# EAGLE design HyperArmBoard (EAGLE 8.6.0)
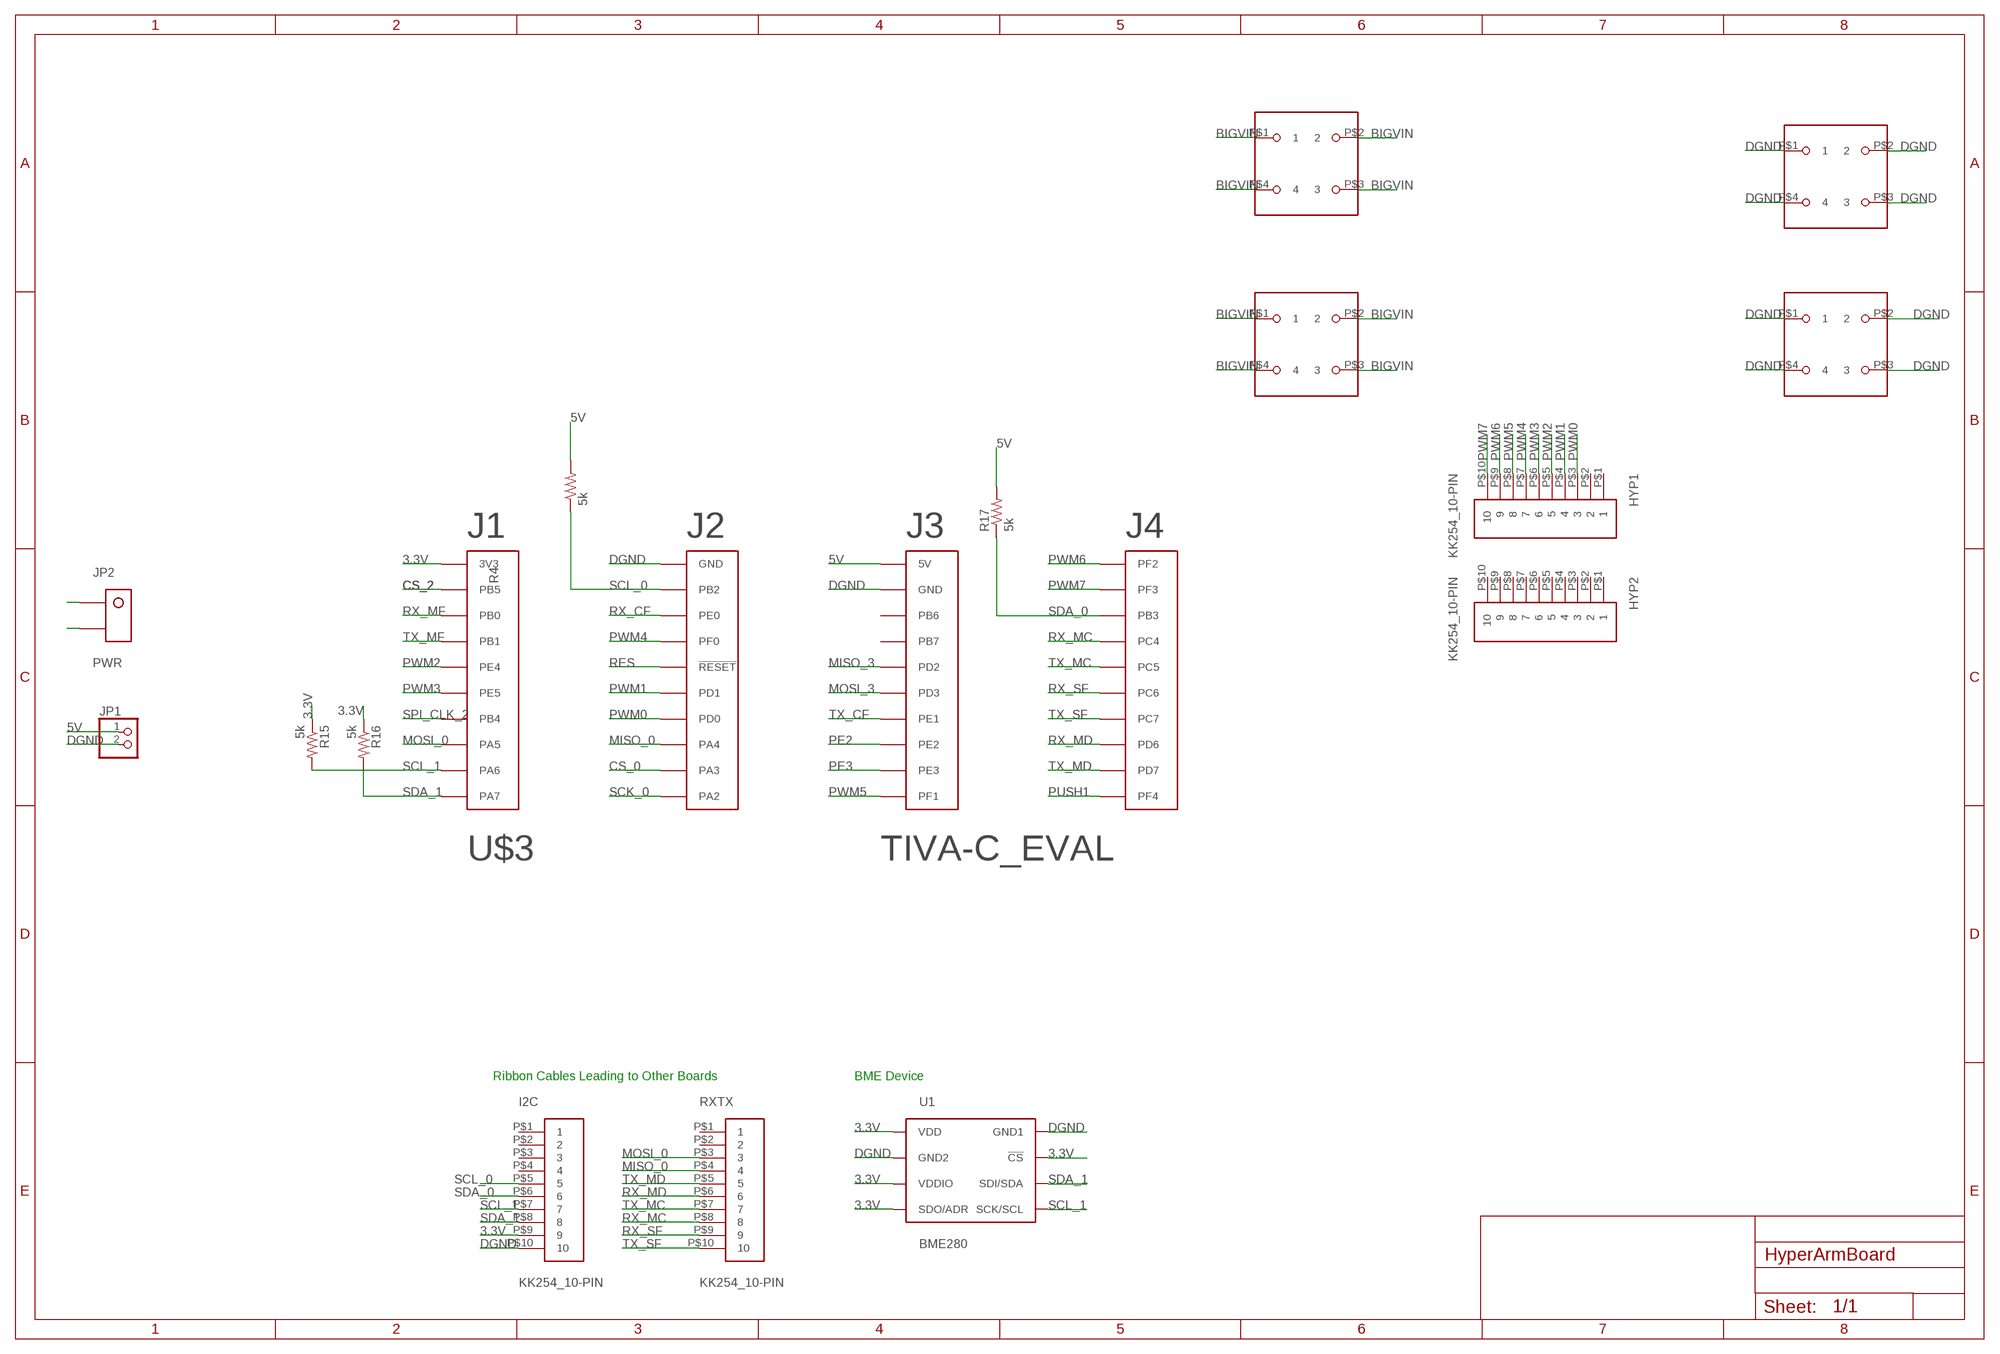
[diagram p0: schematic, sheet 1]

## Parts
HYP1  KK254_10-PIN  [KK254_10-PIN]
HYP2  KK254_10-PIN  [KK254_10-PIN]
I2C  KK254_10-PIN  [KK254_10-PIN]
JP1  PINHD-1X2  [1X02]
JP2  PWR  2_SUPERSABRE  [SUPERSABRE_2CIRCUIT]
R4  5k  R-US_R0805  [R0805]
R15  5k  R-US_R0805  [R0805]
R16  5k  R-US_R0805  [R0805]
R17  5k  R-US_R0805  [R0805]
RXTX  KK254_10-PIN  [KK254_10-PIN]
U1  BME280  [BME280_LGA]
U$3  TIVA-C_EVAL  [TIVA-C_EVAL]
U$4  BCS-106-L-D-PE-BE  [4-PIN-BIGPOWER]
U$5  BCS-106-L-D-PE-BE  [4-PIN-BIGPOWER]
U$6  BCS-106-L-D-PE-BE  [4-PIN-BIGPOWER]
U$7  BCS-106-L-D-PE-BE  [4-PIN-BIGPOWER]

## Nets
3.3V: I2C.P$9 R15.1 R16.1 U1.P$2(!CS) U1.P$5(SDO/ADR) U1.P$6(VDDIO) U1.P$8(VDD) U$3.1-1(3V3)
5V: JP1.1 R4.2 R17.2 U$3.3-1(5V)
BIGVIN: JP2.P$1 U$4.P$1 U$4.P$2 U$4.P$3 U$4.P$4 U$5.P$1 U$5.P$2 U$5.P$3 U$5.P$4
CS_0: U$3.2-9(PA3)
CS_2: U$3.1-2(PB5)
DGND: I2C.P$10 JP1.2 JP2.P$2 U1.P$1(GND1) U1.P$7(GND2) U$3.2-1(GND) U$3.3-2(GND) U$6.P$1 U$6.P$2 U$6.P$3 U$6.P$4 U$7.P$1 U$7.P$2 U$7.P$3 U$7.P$4
MISO_0: RXTX.P$4 U$3.2-8(PA4)
MISO_3: U$3.3-5(PD2)
MOSI_0: RXTX.P$3 U$3.1-8(PA5)
MOSI_3: U$3.3-6(PD3)
PE2: U$3.3-8(PE2)
PE3: U$3.3-9(PE3)
PUSH1: U$3.4-10(PF4)
PWM0: HYP1.P$3 U$3.2-7(PD0)
PWM1: HYP1.P$4 U$3.2-6(PD1)
PWM2: HYP1.P$5 U$3.1-5(PE4)
PWM3: HYP1.P$6 U$3.1-6(PE5)
PWM4: HYP1.P$7 U$3.2-4(PF0)
PWM5: HYP1.P$8 U$3.3-10(PF1)
PWM6: HYP1.P$9 U$3.4-1(PF2)
PWM7: HYP1.P$10 U$3.4-2(PF3)
RES: U$3.2-5(!RESET!)
RX_CF: U$3.2-3(PE0)
RX_MC: RXTX.P$8 U$3.4-4(PC4)
RX_MD: RXTX.P$6 U$3.4-8(PD6)
RX_MF: U$3.1-3(PB0)
RX_SF: RXTX.P$9 U$3.4-6(PC6)
SCK_0: U$3.2-10(PA2)
SCL_0: I2C.P$5 R4.1 U$3.2-2(PB2)
SCL_1: I2C.P$7 R15.2 U1.P$4(SCK/SCL) U$3.1-9(PA6)
SDA_0: I2C.P$6 R17.1 U$3.4-3(PB3)
SDA_1: I2C.P$8 R16.2 U1.P$3(SDI/SDA) U$3.1-10(PA7)
SPI_CLK_2: U$3.1-7(PB4)
TX_CF: U$3.3-7(PE1)
TX_MC: RXTX.P$7 U$3.4-5(PC5)
TX_MD: RXTX.P$5 U$3.4-9(PD7)
TX_MF: U$3.1-4(PB1)
TX_SF: RXTX.P$10 U$3.4-7(PC7)
Unconnected: HYP1.P$1 HYP1.P$2 HYP2.P$1 HYP2.P$2 HYP2.P$3 HYP2.P$4 HYP2.P$5 HYP2.P$6 HYP2.P$7 HYP2.P$8 HYP2.P$9 HYP2.P$10 I2C.P$1 I2C.P$2 I2C.P$3 I2C.P$4 RXTX.P$1 RXTX.P$2 U$3.3-3(PB6) U$3.3-4(PB7)

## Notes on the sheet
- Ribbon Cables Leading to Other Boards | BME Device

## Library data of the parts
HYP1 HYP2 I2C RXTX = molex:KK254_10-PIN: KK254 10-pin Datasheet <http://www.molex.com/molex/products/datasheet.jsp?part=active/0022102101_PCB_HEADERS.xml>
JP1 = pinhead:PINHD-1X2: PIN HEADER
JP2 = molex:2_SUPERSABRE: Molex SuperSabre 2-pin vertical header
R4 R15-R17 = resistor:R-US_: RESISTOR, American symbol
U1 = BME280ComponentLibrary:BME280; PROD_ID: IC-13090
U$3 = texas:TIVA-C_EVAL: Texas Instruments Tiva-C TM4C123G LaunchPad Evaluation Board Part number EK-TM4C123GXL Datasheet <http://www.ti.com/lit/ug/spmu296/spmu296.pdf> Microcontroller <http://www.ti.com/lit/ds/spms376e/spms376e.pdf>
U$4-U$7 = samtec:BCS-106-L-D-PE-BE

## Board
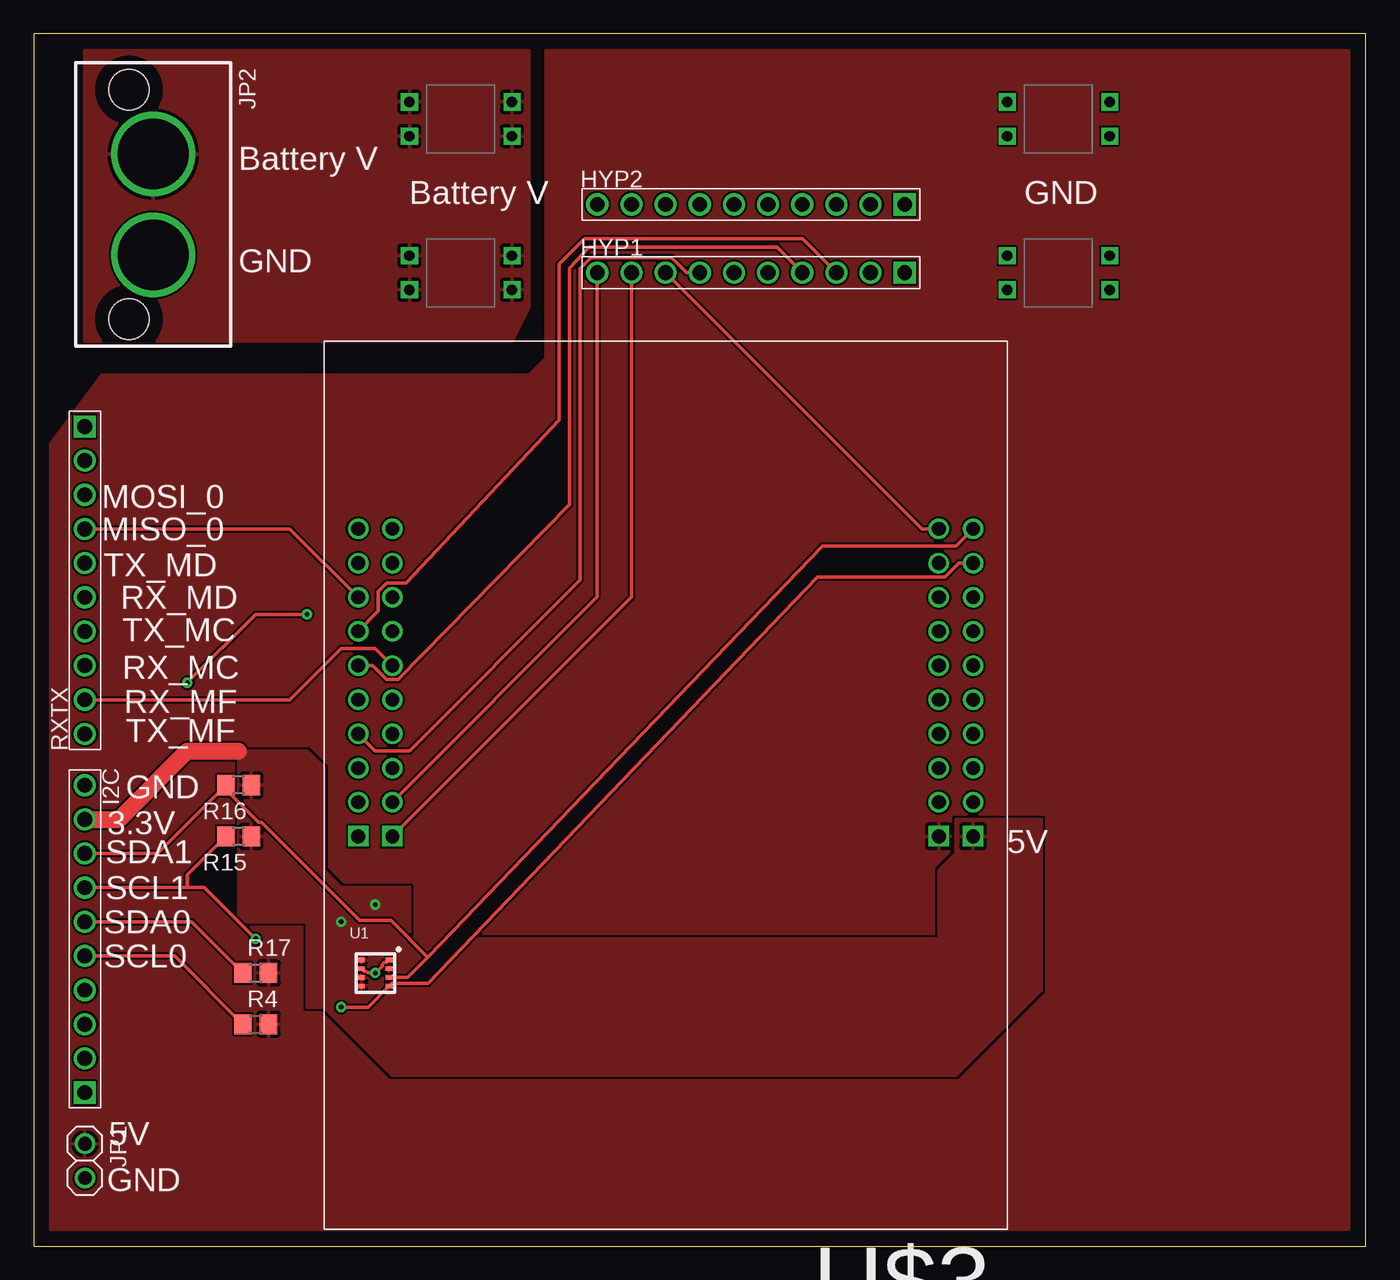
[diagram p1: board, top side]
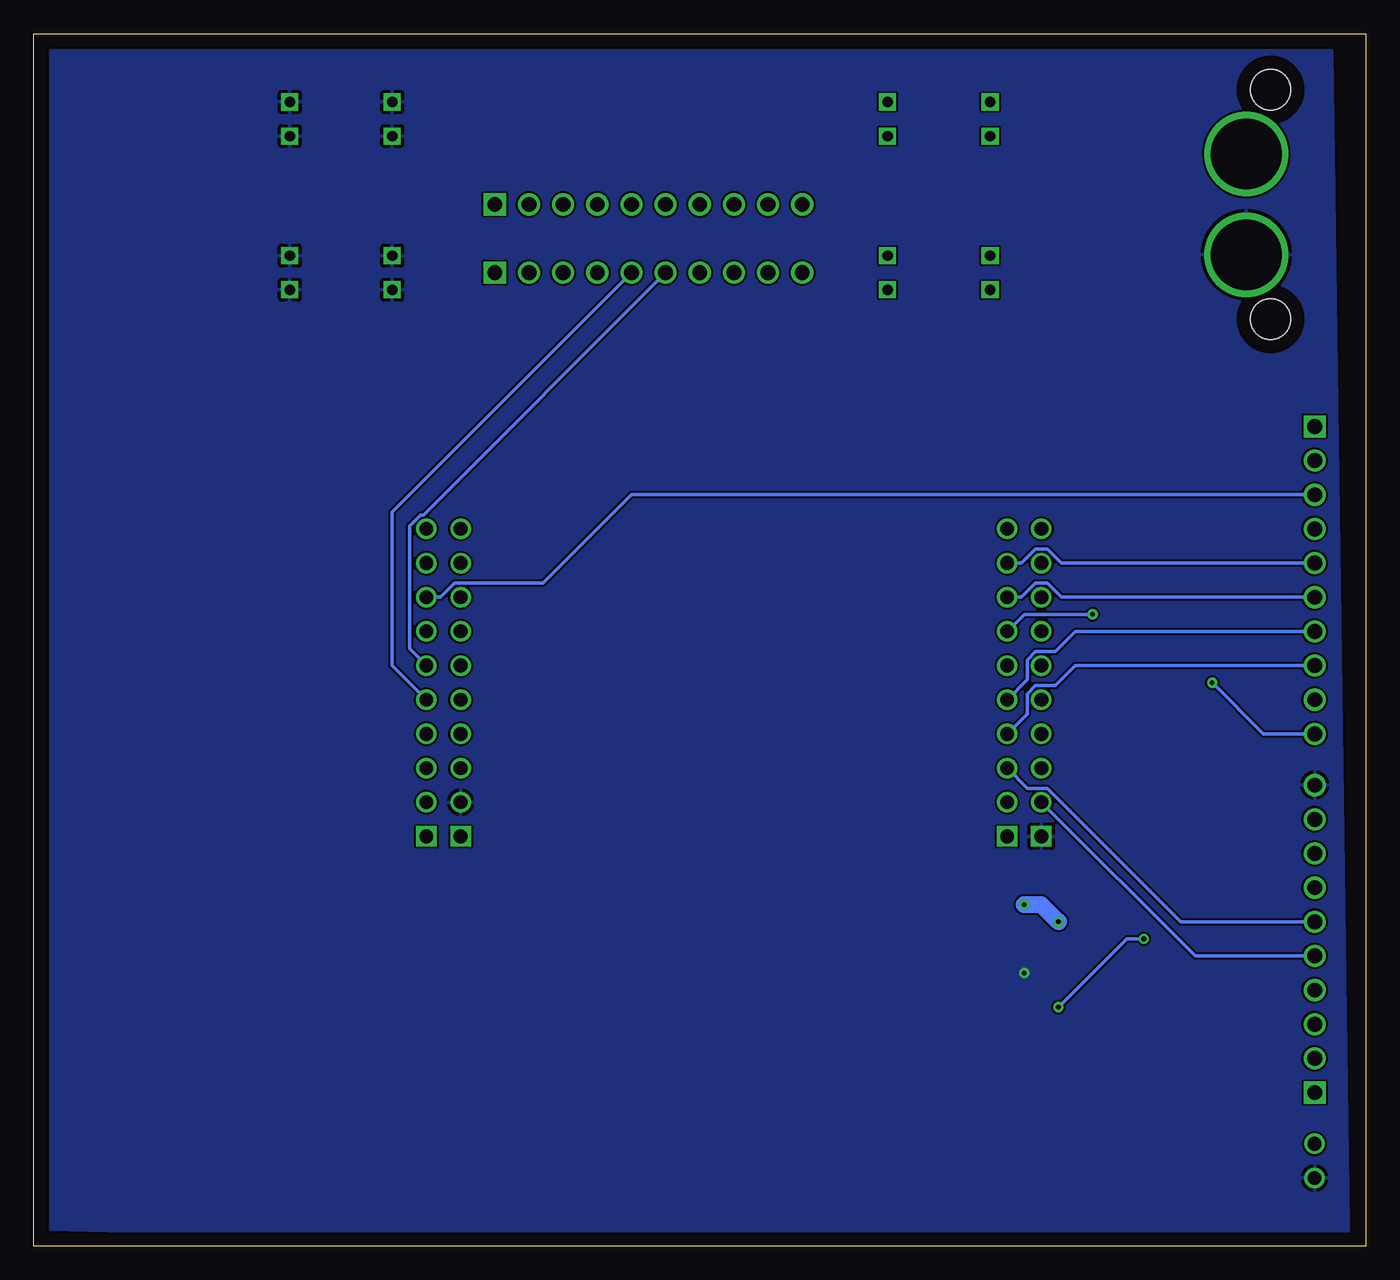
[diagram p2: board, bottom side, seen from below]

Size 99.06 x 90.17 mm. Coordinates in mm from the lower left corner, seen from the top.
Outline: 0,0 99.06,0 99.06,90.17 0,90.17 0,0
Copper layers (1*16): Top 0.035mm / dielectric 1.5mm / Bottom 0.035mm
Design rules "default *": minimum track width 6mil, minimum drill 0.35mm, track to track 6mil, track to pad 6mil, pad to pad 6mil, via to via 6mil, smd to smd 6mil, copper to edge 40mil, drill to drill 6mil, minimum pad ring 10mil, minimum via ring 8mil, stop-mask expansion 4mil, vias tented up to drill 0mil, thermal gap 10mil

### Footprints (pad centres in the part's own frame; a part is rotated, then mirrored left to right if it is on the bottom)
KK254_10-PIN = drill 1.1 square: P$1 11.43,0 | drill 1.1: P$2 8.89,0; P$3 6.35,0; P$4 3.81,0; P$5 1.27,0; P$6 -1.27,0; P$7 -3.81,0; P$8 -6.35,0; P$9 -8.89,0; P$10 -11.43,0
1X02 = drill 1.016: 1 -1.27,0; 2 1.27,0
SUPERSABRE_2CIRCUIT = drill 5.25: P$1 -3.747,0; P$2 3.747,0 | hole 2.997: -8.534,-1.803; 8.534,-1.803
R0805 = smd 1.3 x 1.5: 1 -0.95,0; 2 0.95,0
BME280_LGA = smd 0.5 x 0.35: P$1 1.025,0.975; P$2 1.025,0.325; P$3 1.025,-0.325; P$4 1.025,-0.975; P$5 -1.025,-0.975; P$6 -1.025,-0.325; P$7 -1.025,0.325; P$8 -1.025,0.975
TIVA-C_EVAL = drill 1.016 square: 1-1 -22.86,3.81; 2-1 22.86,3.81; 3-1 -20.32,3.81; 4-1 20.32,3.81 | drill 1.016: 1-2 -22.86,1.27; 1-3 -22.86,-1.27; 1-4 -22.86,-3.81; 1-5 -22.86,-6.35; 1-6 -22.86,-8.89; 1-7 -22.86,-11.43; 1-8 -22.86,-13.97; 1-9 -22.86,-16.51; 1-10 -22.86,-19.05; 2-2 22.86,1.27; 2-3 22.86,-1.27; 2-4 22.86,-3.81; 2-5 22.86,-6.35; 2-6 22.86,-8.89; 2-7 22.86,-11.43; 2-8 22.86,-13.97; 2-9 22.86,-16.51; 2-10 22.86,-19.05; 3-2 -20.32,1.27; 3-3 -20.32,-1.27; 3-4 -20.32,-3.81; 3-5 -20.32,-6.35; 3-6 -20.32,-8.89; 3-7 -20.32,-11.43; 3-8 -20.32,-13.97; 3-9 -20.32,-16.51; 3-10 -20.32,-19.05; 4-2 20.32,1.27; 4-3 20.32,-1.27; 4-4 20.32,-3.81; 4-5 20.32,-6.35; 4-6 20.32,-8.89; 4-7 20.32,-11.43; 4-8 20.32,-13.97; 4-9 20.32,-16.51; 4-10 20.32,-19.05
4-PIN-BIGPOWER = drill 0.762 square: P$1 -1.27,3.81; P$2 1.27,3.81; P$3 1.27,-3.81; P$4 -1.27,-3.81

### Placement (x,y rotation side)
HYP1  53.34,72.39 0 top
HYP2  53.34,77.47 0 top
I2C  3.81,22.86 270 top
JP1  3.81,6.35 270 top
JP2  8.89,77.47 270 top
R4  16.51,16.51 0 top
R15  15.24,30.48 180 top
R16  15.24,34.29 180 top
R17  16.51,20.32 0 top
RXTX  3.81,49.53 90 top
U1  25.4,20.32 0 top
U$3  46.99,34.29 180 top
U$4  31.75,72.39 90 top
U$5  31.75,83.82 90 top
U$6  76.2,83.82 90 top
U$7  76.2,72.39 90 top

### Tracks (layer width: path | path; a pad name or v marks a point on that pad's centre or on a via)
3.3V  (via drill 0.35)
  Top 1.27: I2C.P$9 6.35,31.75 11.43,36.83 15.24,36.83
  Bottom 1.27: v22.86,24.13 24.13,25.4 v25.4,25.4
  pour Top: 22.86,22.86 67.31,22.86 67.31,27.94 68.58,29.21 68.58,31.75 74.93,31.75 74.93,19.05 68.58,12.7 26.67,12.7 21.59,17.78 21.59,21.59
  pour Top: 27.94,17.78 20.32,17.78 20.32,24.13 15.24,24.13 15.24,36.83 20.32,36.83 21.59,35.56 21.59,27.94 22.86,26.67 27.94,26.67
5V
  pour Top (rank 2): 5.08,64.77 36.83,64.77 38.1,66.04 38.1,88.9 97.79,88.9 97.79,1.27 1.27,1.27 1.27,59.69
BIGVIN
  pour Top: 3.81,88.9 36.83,88.9 36.83,69.85 35.56,67.31 3.81,67.31
DGND  (via drill 0.35)
  Top 0.254: U1.P$7 24.57,20.45 24.74,20.45 24.87,20.32 v25.4,20.32 25.9,20.82 25.9,20.94 26.06,21.1 26.23,21.1 U1.P$1
  pour Bottom: 2.54,88.9 1.27,-1.27 97.79,1.27 97.79,88.9
MISO_0
  Top 0.254: RXTX.P$4 19.05,53.34 U$3.2-8
MOSI_0
  Bottom 0.254: RXTX.P$3 54.61,55.88 61.19,49.3 67.74,49.3 68.78,48.26 U$3.1-8
PWM0
  Top 0.254: U$3.2-7 25.63,47.22 25.63,48.69 26.24,49.3 27.71,49.3 39.06,61.42 39.06,73.02 40.98,74.93 57.15,74.93 HYP1.P$3
PWM1
  Top 0.254: U$3.2-6 25.2,43.18 26.24,42.14 27.1,42.14 39.85,55.14 39.85,72.72 41.28,74.28 55.26,74.28 HYP1.P$4
PWM2
  Bottom 0.254: HYP1.P$5 72.39,54.61 72.39,43.18 U$3.1-5
PWM3
  Bottom 0.254: HYP1.P$6 70.08,54.38 70.28,54.38 71.12,53.54 71.12,44.45 U$3.1-6
PWM4
  Top 0.254: HYP1.P$7 48.55,72.39 47.45,73.49 41.45,73.49 40.64,72.68 40.64,49.53 27.94,36.83 25.4,36.83 U$3.2-4
PWM5
  Top 0.254: HYP1.P$8 66.04,53.34 U$3.3-10
PWM6
  Top 0.254: HYP1.P$9 44.45,48.26 U$3.4-1
PWM7
  Top 0.254: HYP1.P$10 41.91,48.26 U$3.4-2
RX_MC
  Bottom 0.254: RXTX.P$8 21.59,43.18 23.09,41.68 24.56,41.68 25.17,41.07 25.17,39.6 U$3.4-4
RX_MD
  Bottom 0.254: RXTX.P$6 22.66,48.26 23.7,49.3 24.56,49.3 25.6,48.26 U$3.4-8
RX_SF
  Top 0.254: RXTX.P$9 19.05,40.64 22.86,44.45 25.4,44.45 U$3.4-6
SCL_0
  Top 0.254: R4.1 10.48,21.59 I2C.P$5
  Bottom 0.254: I2C.P$5 12.7,21.59 U$3.2-2
SCL_1  (via drill 0.35)
  Top 0.254: U$3.1-9 68.78,50.8 67.74,49.76 58.28,49.76 55.75,47.12 29.33,19.54 26.62,19.54 U1.P$4 24.86,17.78 v22.86,17.78 | v16.51,22.86 12.7,26.67 11.43,26.67 | 11.43,26.67 I2C.P$7 | R15.2 11.43,27.62 11.43,26.67
  Bottom 0.254: v22.86,17.78 17.78,22.86 v16.51,22.86
SDA_0
  Top 0.254: R17.1 11.75,24.13 I2C.P$6
  Bottom 0.254: U$3.4-3 25.17,34.06 23.7,34.06 13.77,24.13 I2C.P$6
SDA_1
  Top 0.254: I2C.P$8 9.21,29.21 14.13,34.13 | 14.13,34.13 R16.2 | 29.37,21.55 29.31,21.49 26.57,24.23 24.23,24.23 16.96,31.51 16.75,31.51 14.13,34.13 | 29.37,21.55 58.67,52.07 68.58,52.07 U$3.1-10 | U1.P$3 27.81,20 29.37,21.55
TX_MC
  Bottom 0.254: RXTX.P$7 21.59,45.72 23.09,44.22 24.56,44.22 25.17,43.61 25.17,42.14 U$3.4-5
TX_MD
  Bottom 0.254: RXTX.P$5 22.66,50.8 23.7,51.84 24.56,51.84 25.6,50.8 U$3.4-9
TX_SF  (via drill 0.35)
  Top 0.254: v11.43,41.91 16.51,46.99 v20.32,46.99
  Bottom 0.254: RXTX.P$10 7.62,38.1 v11.43,41.91 | v20.32,46.99 25.4,46.99 U$3.4-7

### Text on the board
tPlace: Battery V | Battery V | GND | GND | MOSI_0 | MISO_0 | TX_MD | RX_MD | TX_MC | RX_MC | RX_MF | TX_MF | GND | 3.3V | 5V | SDA1 | SCL1 | SDA0 | SCL0 | 5V
tSilk: GND